# EAGLE schematic ledB_sch-raw (EAGLE 9.4.1)
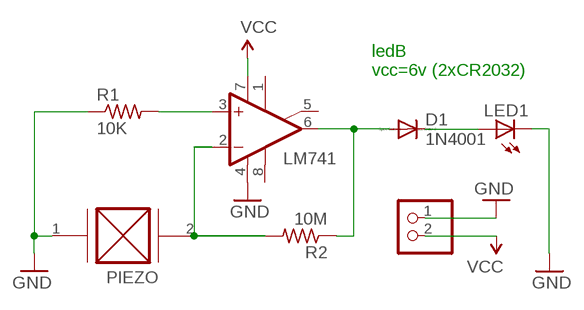
[diagram p0: schematic, sheet 1]

## Parts
D1  1N4001  DIODE-DO-214AC  [DO-214AC]
JP1  6V+  HEADER-1X2ROUND  [1X02_ROUND]
LED1  LED1206  [LED-1206]
OPAMP  LM741  LM741D  [SO08]
PIEZO  PIEZO  [1X02_ROUND]
R1  10K  R-US_M1206  [M1206]
R2  10M  R-US_M1206  [M1206]

## Nets
GND: JP1.1 LED1.C OPAMP.4(V-) PIEZO.1(GND) R1.1
N$1: OPAMP.3(+IN) R1.2
N$2: D1.A OPAMP.6(OUT) R2.1
N$5: D1.C LED1.A
SIG: OPAMP.2(-IN) PIEZO.2(OUT+) R2.2
VCC: JP1.2 OPAMP.7(V+)
Unconnected: OPAMP.1(ON1) OPAMP.5(ON2) OPAMP.8(OPT)

## Notes on the sheet
- ledB
  vcc=6v (2xCR2032)

## Library data of the parts
D1 = diode:DIODE-: DIODE
JP1 = ledB_sch:HEADER-1X2: PIN HEADER
LED1 = ledB_sch:LED: LEDs Standard schematic elements and footprints for 5mm, 3mm, 1206, and 0603 sized LEDs. 5mm - Spark Fun Electronics SKU : COM-00529 (and others)
OPAMP = ledB_sch:*741: OP AMP
PIEZO = ledB_sch:PIEZO
R1 R2 = ledB_sch:R-US_: RESISTOR, American symbol